# Altium schematic sheet InterfaceBoard.SchDoc
size B; SheetNumber: 4; SheetTotal: 11
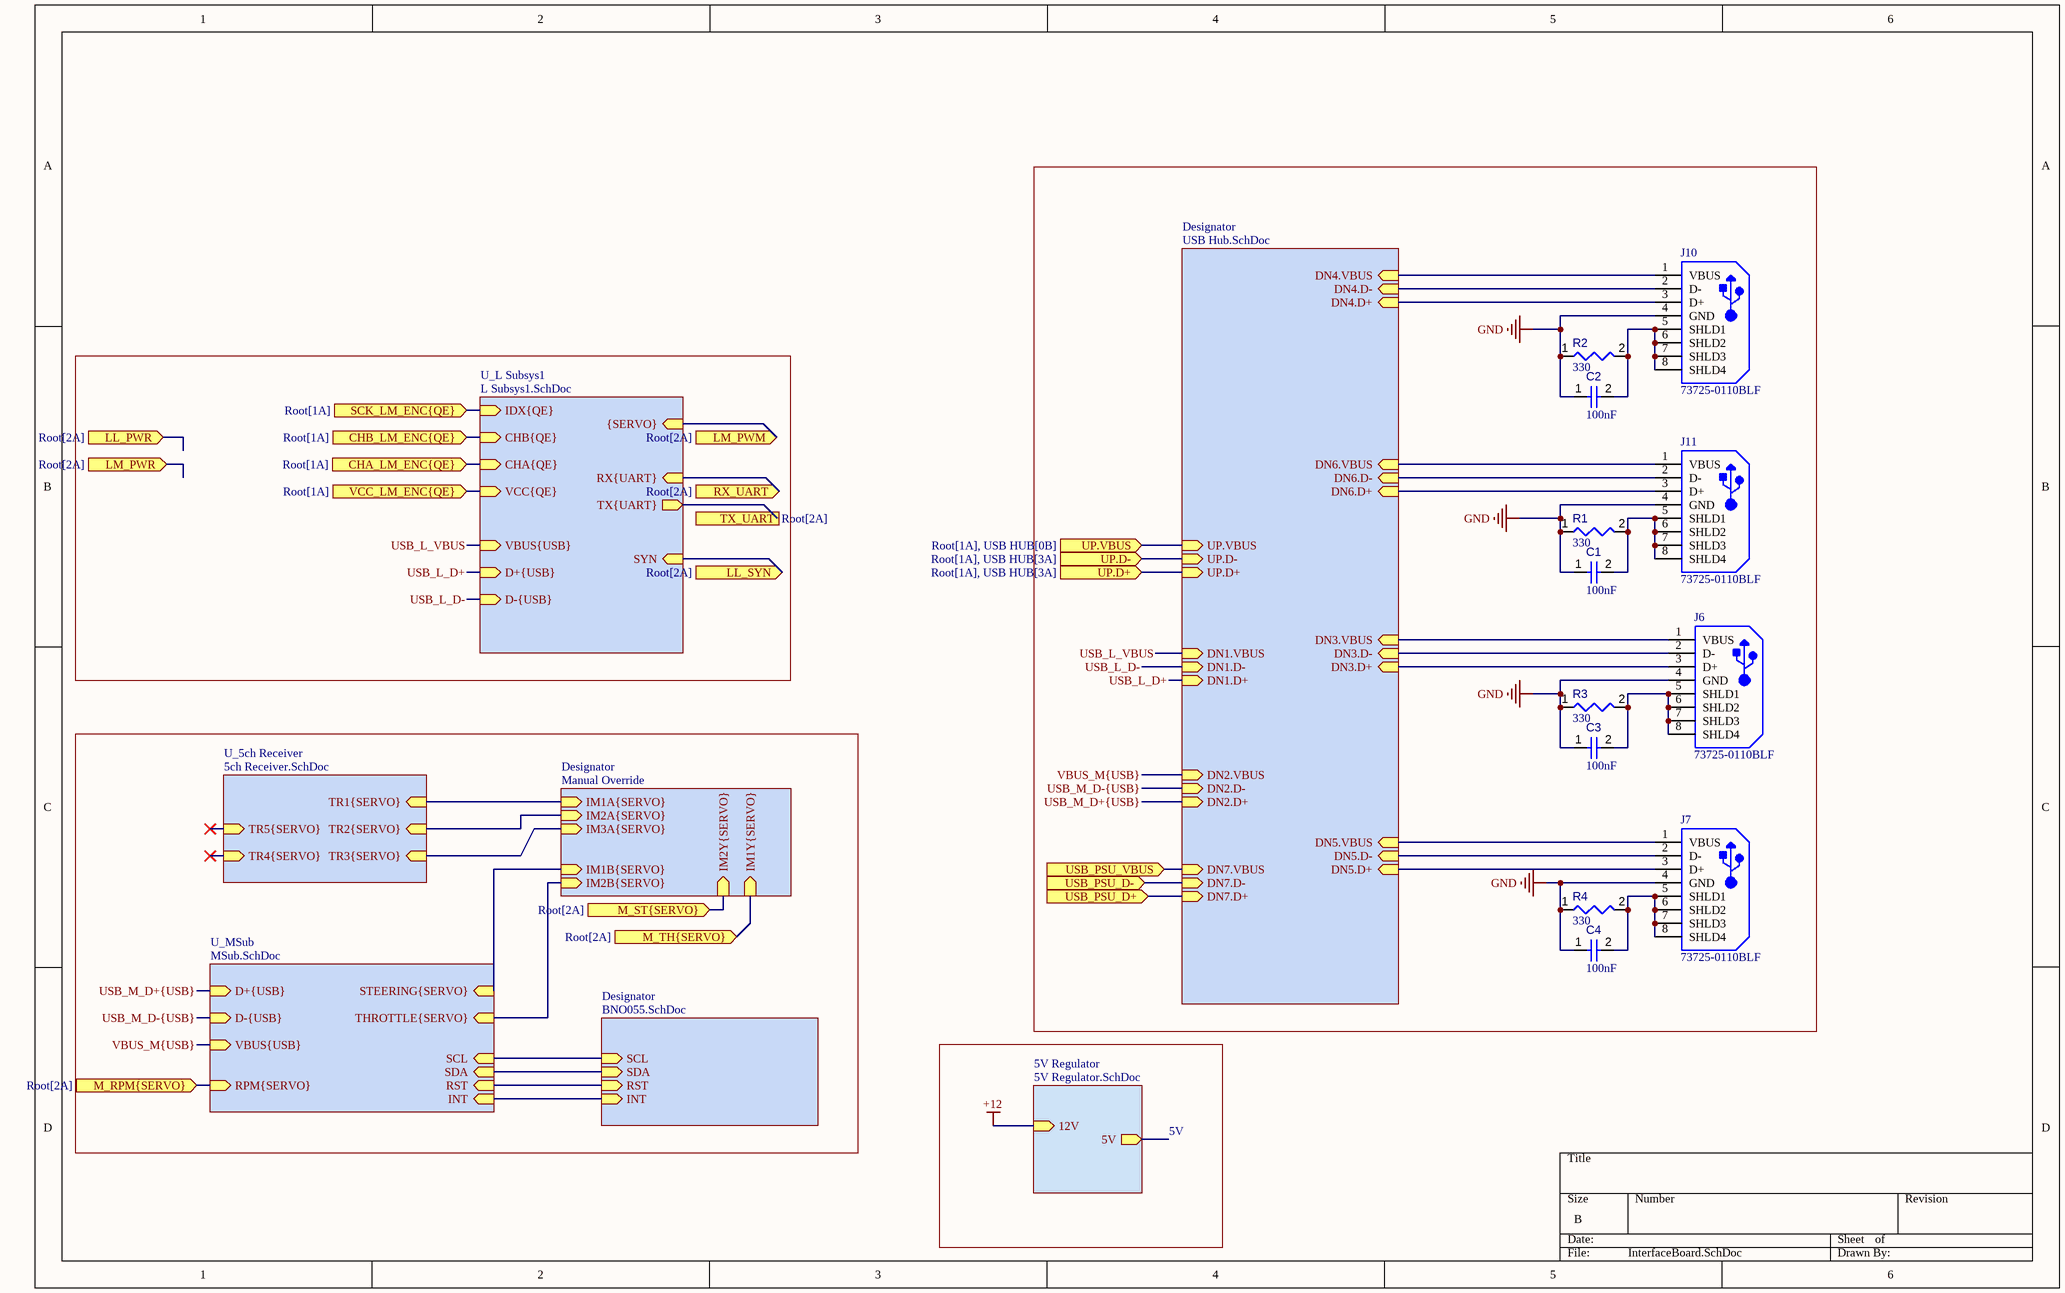
[diagram p0: InterfaceBoard.SchDoc]

## Parts
C1  value 100nF  [CAPC1005X56X25LL10T15]  (hidden comment: Capacitor 0.1 uF +/- 5% 16 V 0402)
C2  value 100nF  [CAPC1005X56X25LL10T15]  (hidden comment: Capacitor 0.1 uF +/- 5% 16 V 0402)
C3  value 100nF  [CAPC1005X56X25LL10T15]  (hidden comment: Capacitor 0.1 uF +/- 5% 16 V 0402)
C4  value 100nF  [CAPC1005X56X25LL10T15]  (hidden comment: Capacitor 0.1 uF +/- 5% 16 V 0402)
J6  73725-0110BLF  [FCI-73725-0110BLF_V]
J7  73725-0110BLF  [FCI-73725-0110BLF_V]
J10  73725-0110BLF  [FCI-73725-0110BLF_V]
J11  73725-0110BLF  [FCI-73725-0110BLF_V]
R1  value 330  [RESC0402(1005)_L]  (hidden comment: Resistor 330R +/-5 % 0402 63 mW)
R2  value 330  [RESC0402(1005)_L]  (hidden comment: Resistor 330R +/-5 % 0402 63 mW)
R3  value 330  [RESC0402(1005)_L]  (hidden comment: Resistor 330R +/-5 % 0402 63 mW)
R4  value 330  [RESC0402(1005)_L]  (hidden comment: Resistor 330R +/-5 % 0402 63 mW)

## Sub-sheets
5V Regulator = 5V Regulator.SchDoc: 12V (in), 5V (out)
Designator = Manual Override: IM1A{SERVO} (in), IM2A{SERVO} (in), IM3A{SERVO} (in), IM1B{SERVO} (in), IM2B{SERVO} (in), IM1Y{SERVO} (in), IM2Y{SERVO} (in)
Designator = BNO055.SchDoc: RST (in), SDA (in), INT (in), SCL (in)
Designator = USB Hub.SchDoc: DN4.VBUS (in), DN4.D- (in), DN4.D+ (in), DN6.VBUS (in), DN6.D- (in), DN6.D+ (in), DN3.VBUS (in), DN3.D- (in), DN3.D+ (in), DN5.VBUS (in), DN5.D- (in), DN5.D+ (in), DN7.D+ (in), DN7.D- (in), DN7.VBUS (in), DN2.D+ (in), DN2.D- (in), DN2.VBUS (in), DN1.D+ (in), DN1.D- (in), DN1.VBUS (in), UP.VBUS (in), UP.D+ (in), UP.D- (in)
U_5ch Receiver = 5ch Receiver.SchDoc: TR2{SERVO} (in), TR5{SERVO} (in), TR3{SERVO} (in), TR1{SERVO} (in), TR4{SERVO} (in)
U_L Subsys1 = L Subsys1.SchDoc: IDX{QE} (in), CHB{QE} (in), CHA{QE} (in), VCC{QE} (in), VBUS{USB} (in), D+{USB} (in), D-{USB} (in), {SERVO} (in), RX{UART} (in), TX{UART} (out), SYN (in)
U_MSub = MSub.SchDoc: D+{USB} (in), RPM{SERVO} (in), STEERING{SERVO} (in), THROTTLE{SERVO} (in), SDA (in), INT (in), RST (in), SCL (in), D-{USB} (in), VBUS{USB} (in)

## Ports
CHA_LM_ENC{QE} (in, see Root[1A]), CHB_LM_ENC{QE} (in, see Root[1A]), LL_PWR (in, see Root[2A]), LL_SYN (in, see Root[2A]), LM_PWM (in, see Root[2A]), LM_PWR (in, see Root[2A]), M_RPM{SERVO} (in, see Root[2A]), M_ST{SERVO} (in, see Root[2A]), M_TH{SERVO} (in, see Root[2A]), RX_UART (in, see Root[2A]), SCK_LM_ENC{QE} (in, see Root[1A]), TX_UART (out, see Root[2A]), UP.D+ (in, see Root[1A], USB HUB[3A]), UP.D- (in, see Root[1A], USB HUB[3A]), UP.VBUS (in, see Root[1A], USB HUB[0B]), USB_PSU_D+ (in), USB_PSU_D- (in), USB_PSU_VBUS (in), VCC_LM_ENC{QE} (in, see Root[1A])

## Nets
+12: sheet 5V Regulator/12V
GND: C1.1 C2.1 C3.1 C4.1 J6.4(GND) J7.4(GND) J10.4(GND) J11.4(GND) R1.1 R2.1 R3.1 R4.1
CHA_LM_ENC{QE}: port CHA_LM_ENC{QE}, sheet U_L Subsys1/CHA{QE}
CHB_LM_ENC{QE}: port CHB_LM_ENC{QE}, sheet U_L Subsys1/CHB{QE}
LL_SYN: port LL_SYN, sheet U_L Subsys1/SYN
LM_PWM: port LM_PWM, sheet U_L Subsys1/{SERVO}
M_RPM{SERVO}: port M_RPM{SERVO}, sheet U_MSub/RPM{SERVO}
M_ST{SERVO}: port M_ST{SERVO}, sheet Designator/IM2Y{SERVO}
M_TH{SERVO}: port M_TH{SERVO}, sheet Designator/IM1Y{SERVO}
RX_UART: port RX_UART, sheet U_L Subsys1/RX{UART}
SCK_LM_ENC{QE}: port SCK_LM_ENC{QE}, sheet U_L Subsys1/IDX{QE}
UP.D+: port UP.D+, sheet Designator/UP.D+
UP.D-: port UP.D-, sheet Designator/UP.D-
UP.VBUS: port UP.VBUS, sheet Designator/UP.VBUS
USB_L_D+: sheet U_L Subsys1/D+{USB}, sheet Designator/DN1.D+
USB_L_D-: sheet U_L Subsys1/D-{USB}, sheet Designator/DN1.D-
USB_L_VBUS: sheet U_L Subsys1/VBUS{USB}, sheet Designator/DN1.VBUS
USB_M_D+{USB}: sheet U_MSub/D+{USB}, sheet Designator/DN2.D+
USB_M_D-{USB}: sheet U_MSub/D-{USB}, sheet Designator/DN2.D-
USB_PSU_D+: port USB_PSU_D+, sheet Designator/DN7.D+
USB_PSU_D-: port USB_PSU_D-, sheet Designator/DN7.D-
USB_PSU_VBUS: port USB_PSU_VBUS, sheet Designator/DN7.VBUS
VBUS_M{USB}: sheet U_MSub/VBUS{USB}, sheet Designator/DN2.VBUS
VCC_LM_ENC{QE}: port VCC_LM_ENC{QE}, sheet U_L Subsys1/VCC{QE}
NetC1_2: C1.2 J11.5(SHLD1) J11.6(SHLD2) J11.7(SHLD3) J11.8(SHLD4) R1.2
NetC2_2: C2.2 J10.5(SHLD1) J10.6(SHLD2) J10.7(SHLD3) J10.8(SHLD4) R2.2
NetC3_2: C3.2 J6.5(SHLD1) J6.6(SHLD2) J6.7(SHLD3) J6.8(SHLD4) R3.2
NetC4_2: C4.2 J7.5(SHLD1) J7.6(SHLD2) J7.7(SHLD3) J7.8(SHLD4) R4.2
NetJ6_1: J6.1(VBUS) ; sheet Designator/DN3.VBUS
NetJ6_2: J6.2(D-) ; sheet Designator/DN3.D-
NetJ6_3: J6.3(D+) ; sheet Designator/DN3.D+
NetJ7_1: J7.1(VBUS) ; sheet Designator/DN5.VBUS
NetJ7_2: J7.2(D-) ; sheet Designator/DN5.D-
NetJ7_3: J7.3(D+) ; sheet Designator/DN5.D+
NetJ10_1: J10.1(VBUS) ; sheet Designator/DN4.VBUS
NetJ10_2: J10.2(D-) ; sheet Designator/DN4.D-
NetJ10_3: J10.3(D+) ; sheet Designator/DN4.D+
NetJ11_1: J11.1(VBUS) ; sheet Designator/DN6.VBUS
NetJ11_2: J11.2(D-) ; sheet Designator/DN6.D-
NetJ11_3: J11.3(D+) ; sheet Designator/DN6.D+
(unnamed): sheet Designator/IM1A{SERVO}, sheet U_5ch Receiver/TR1{SERVO}
(unnamed): sheet Designator/IM2A{SERVO}, sheet U_5ch Receiver/TR2{SERVO}
(unnamed): sheet Designator/IM3A{SERVO}, sheet U_5ch Receiver/TR3{SERVO}
(unnamed): sheet Designator/IM1B{SERVO}, sheet U_MSub/STEERING{SERVO}
(unnamed): sheet Designator/IM2B{SERVO}, sheet U_MSub/THROTTLE{SERVO}
(unnamed): sheet Designator/RST, sheet U_MSub/RST
(unnamed): sheet Designator/SDA, sheet U_MSub/SDA
(unnamed): sheet Designator/INT, sheet U_MSub/INT
(unnamed): sheet Designator/SCL, sheet U_MSub/SCL

## Notes on the sheet
- 5V

## Library data of the parts
C1-C4 = CMP-001-00001-6: Chip Capacitor, 0.1 uF, +/- 5%, 16 V, 0402 (1005 Metric); Capacitor Type: Ceramic; Voltage Rating: 16V; Max Operating Temperature: 125°C; Min Operating Temperature: -55°C; Case/Package: 0402; Mounting Technology: SM; Pins: 2; Tolerance: 5%; RoHS Compliant: True
J6 J7 J10 J11 = CMP-2000-05674-1: USB-A 2.0 Receptacle Connector, RA, -40 to 85 degC, 4-Pin THD, RoHS, Tube; Number of Contacts: 4; Brand: FCI; Number of Ports: 1; Gender: Female; Connector Type: USBTypeAReceptacle,Upright; Mounting Angle: Right; Datasheet Version: Rev. AH, 09/2015; RoHS: Details; Shell Plating: Tin; Packaging: Tube; Mounting Style: ThroughHole; Standard: USB2.0; Features: Singlestack,nobackshield,withoutsensorcontact; Factory Pack Quantity: 30; Package Reference: 73725-0110BLF; Flammability Rating: UL94V-0; Product: USBTypeAConnectors; Series: USB; Number of Positions / Contacts: 4; Manufacturer: FCI; Contact Material: CopperAlloy; Datasheet URL: http://portal.fciconnect.com/Comergent//fci/drawing/73725.pdf; Product Category: USBConnectors; Mounting Technology: ThroughHole; Termination Style: SolderPin; Package Description: 4-Pin Throug Hole Device, Body 19.7 x 5.76 mm, Pitch 2 mm; Manufacturer URL: http://portal.fciconnect.com/; Color: White; Contact Plating: PalladiumNickelAlloy(GXT); Number of Positions: 4
R1-R4 = CMP-009-00132-3: Chip Resistor, 330 Ohms, +/-5 %, 63 mW, -55 to 155 degC, 0402; Power: 63mW; Tolerance: 5%; Pins: 2; Max Operating Temperature: 155°C; Min Operating Temperature: -55°C; Case/Package: 0402